# Altium schematic sheet Mosquito.SchDoc
size A4
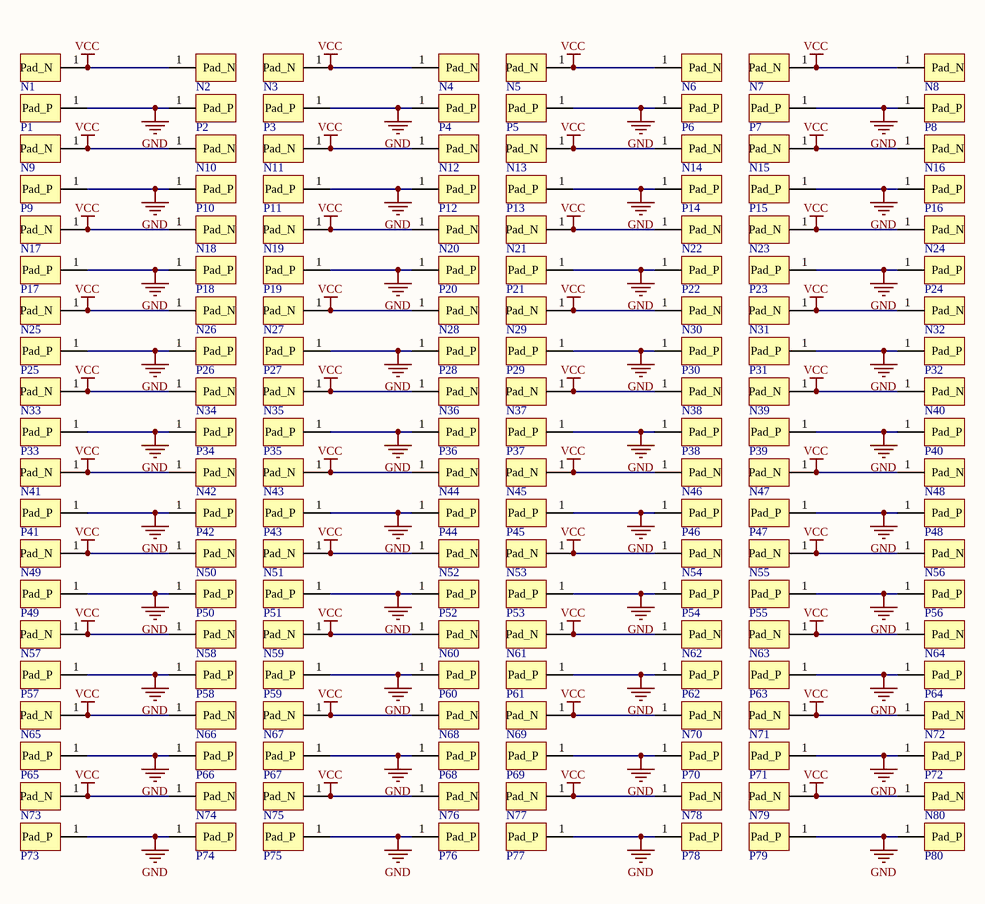
[diagram p0: Mosquito.SchDoc]

## Parts
N1  Pad_N  [Pad]  (value not drawn)
N2  Pad_N  [Pad]  (value not drawn)
N3  Pad_N  [Pad]  (value not drawn)
N4  Pad_N  [Pad]  (value not drawn)
N5  Pad_N  [Pad]  (value not drawn)
N6  Pad_N  [Pad]  (value not drawn)
N7  Pad_N  [Pad]  (value not drawn)
N8  Pad_N  [Pad]  (value not drawn)
N9  Pad_N  [Pad]  (value not drawn)
N10  Pad_N  [Pad]  (value not drawn)
N11  Pad_N  [Pad]  (value not drawn)
N12  Pad_N  [Pad]  (value not drawn)
N13  Pad_N  [Pad]  (value not drawn)
N14  Pad_N  [Pad]  (value not drawn)
N15  Pad_N  [Pad]  (value not drawn)
N16  Pad_N  [Pad]  (value not drawn)
N17  Pad_N  [Pad]  (value not drawn)
N18  Pad_N  [Pad]  (value not drawn)
N19  Pad_N  [Pad]  (value not drawn)
N20  Pad_N  [Pad]  (value not drawn)
N21  Pad_N  [Pad]  (value not drawn)
N22  Pad_N  [Pad]  (value not drawn)
N23  Pad_N  [Pad]  (value not drawn)
N24  Pad_N  [Pad]  (value not drawn)
N25  Pad_N  [Pad]  (value not drawn)
N26  Pad_N  [Pad]  (value not drawn)
N27  Pad_N  [Pad]  (value not drawn)
N28  Pad_N  [Pad]  (value not drawn)
N29  Pad_N  [Pad]  (value not drawn)
N30  Pad_N  [Pad]  (value not drawn)
N31  Pad_N  [Pad]  (value not drawn)
N32  Pad_N  [Pad]  (value not drawn)
N33  Pad_N  [Pad]  (value not drawn)
N34  Pad_N  [Pad]  (value not drawn)
N35  Pad_N  [Pad]  (value not drawn)
N36  Pad_N  [Pad]  (value not drawn)
N37  Pad_N  [Pad]  (value not drawn)
N38  Pad_N  [Pad]  (value not drawn)
N39  Pad_N  [Pad]  (value not drawn)
N40  Pad_N  [Pad]  (value not drawn)
N41  Pad_N  [Pad]  (value not drawn)
N42  Pad_N  [Pad]  (value not drawn)
N43  Pad_N  [Pad]  (value not drawn)
N44  Pad_N  [Pad]  (value not drawn)
N45  Pad_N  [Pad]  (value not drawn)
N46  Pad_N  [Pad]  (value not drawn)
N47  Pad_N  [Pad]  (value not drawn)
N48  Pad_N  [Pad]  (value not drawn)
N49  Pad_N  [Pad]  (value not drawn)
N50  Pad_N  [Pad]  (value not drawn)
N51  Pad_N  [Pad]  (value not drawn)
N52  Pad_N  [Pad]  (value not drawn)
N53  Pad_N  [Pad]  (value not drawn)
N54  Pad_N  [Pad]  (value not drawn)
N55  Pad_N  [Pad]  (value not drawn)
N56  Pad_N  [Pad]  (value not drawn)
N57  Pad_N  [Pad]  (value not drawn)
N58  Pad_N  [Pad]  (value not drawn)
N59  Pad_N  [Pad]  (value not drawn)
N60  Pad_N  [Pad]  (value not drawn)
N61  Pad_N  [Pad]  (value not drawn)
N62  Pad_N  [Pad]  (value not drawn)
N63  Pad_N  [Pad]  (value not drawn)
N64  Pad_N  [Pad]  (value not drawn)
N65  Pad_N  [Pad]  (value not drawn)
N66  Pad_N  [Pad]  (value not drawn)
N67  Pad_N  [Pad]  (value not drawn)
N68  Pad_N  [Pad]  (value not drawn)
N69  Pad_N  [Pad]  (value not drawn)
N70  Pad_N  [Pad]  (value not drawn)
N71  Pad_N  [Pad]  (value not drawn)
N72  Pad_N  [Pad]  (value not drawn)
N73  Pad_N  [Pad]  (value not drawn)
N74  Pad_N  [Pad]  (value not drawn)
N75  Pad_N  [Pad]  (value not drawn)
N76  Pad_N  [Pad]  (value not drawn)
N77  Pad_N  [Pad]  (value not drawn)
N78  Pad_N  [Pad]  (value not drawn)
N79  Pad_N  [Pad]  (value not drawn)
N80  Pad_N  [Pad]  (value not drawn)
P1  Pad_P  [Pad]  (value not drawn)
P2  Pad_P  [Pad]  (value not drawn)
P3  Pad_P  [Pad]  (value not drawn)
P4  Pad_P  [Pad]  (value not drawn)
P5  Pad_P  [Pad]  (value not drawn)
P6  Pad_P  [Pad]  (value not drawn)
P7  Pad_P  [Pad]  (value not drawn)
P8  Pad_P  [Pad]  (value not drawn)
P9  Pad_P  [Pad]  (value not drawn)
P10  Pad_P  [Pad]  (value not drawn)
P11  Pad_P  [Pad]  (value not drawn)
P12  Pad_P  [Pad]  (value not drawn)
P13  Pad_P  [Pad]  (value not drawn)
P14  Pad_P  [Pad]  (value not drawn)
P15  Pad_P  [Pad]  (value not drawn)
P16  Pad_P  [Pad]  (value not drawn)
P17  Pad_P  [Pad]  (value not drawn)
P18  Pad_P  [Pad]  (value not drawn)
P19  Pad_P  [Pad]  (value not drawn)
P20  Pad_P  [Pad]  (value not drawn)
P21  Pad_P  [Pad]  (value not drawn)
P22  Pad_P  [Pad]  (value not drawn)
P23  Pad_P  [Pad]  (value not drawn)
P24  Pad_P  [Pad]  (value not drawn)
P25  Pad_P  [Pad]  (value not drawn)
P26  Pad_P  [Pad]  (value not drawn)
P27  Pad_P  [Pad]  (value not drawn)
P28  Pad_P  [Pad]  (value not drawn)
P29  Pad_P  [Pad]  (value not drawn)
P30  Pad_P  [Pad]  (value not drawn)
P31  Pad_P  [Pad]  (value not drawn)
P32  Pad_P  [Pad]  (value not drawn)
P33  Pad_P  [Pad]  (value not drawn)
P34  Pad_P  [Pad]  (value not drawn)
P35  Pad_P  [Pad]  (value not drawn)
P36  Pad_P  [Pad]  (value not drawn)
P37  Pad_P  [Pad]  (value not drawn)
P38  Pad_P  [Pad]  (value not drawn)
P39  Pad_P  [Pad]  (value not drawn)
P40  Pad_P  [Pad]  (value not drawn)
P41  Pad_P  [Pad]  (value not drawn)
P42  Pad_P  [Pad]  (value not drawn)
P43  Pad_P  [Pad]  (value not drawn)
P44  Pad_P  [Pad]  (value not drawn)
P45  Pad_P  [Pad]  (value not drawn)
P46  Pad_P  [Pad]  (value not drawn)
P47  Pad_P  [Pad]  (value not drawn)
P48  Pad_P  [Pad]  (value not drawn)
P49  Pad_P  [Pad]  (value not drawn)
P50  Pad_P  [Pad]  (value not drawn)
P51  Pad_P  [Pad]  (value not drawn)
P52  Pad_P  [Pad]  (value not drawn)
P53  Pad_P  [Pad]  (value not drawn)
P54  Pad_P  [Pad]  (value not drawn)
P55  Pad_P  [Pad]  (value not drawn)
P56  Pad_P  [Pad]  (value not drawn)
P57  Pad_P  [Pad]  (value not drawn)
P58  Pad_P  [Pad]  (value not drawn)
P59  Pad_P  [Pad]  (value not drawn)
P60  Pad_P  [Pad]  (value not drawn)
P61  Pad_P  [Pad]  (value not drawn)
P62  Pad_P  [Pad]  (value not drawn)
P63  Pad_P  [Pad]  (value not drawn)
P64  Pad_P  [Pad]  (value not drawn)
P65  Pad_P  [Pad]  (value not drawn)
P66  Pad_P  [Pad]  (value not drawn)
P67  Pad_P  [Pad]  (value not drawn)
P68  Pad_P  [Pad]  (value not drawn)
P69  Pad_P  [Pad]  (value not drawn)
P70  Pad_P  [Pad]  (value not drawn)
P71  Pad_P  [Pad]  (value not drawn)
P72  Pad_P  [Pad]  (value not drawn)
P73  Pad_P  [Pad]  (value not drawn)
P74  Pad_P  [Pad]  (value not drawn)
P75  Pad_P  [Pad]  (value not drawn)
P76  Pad_P  [Pad]  (value not drawn)
P77  Pad_P  [Pad]  (value not drawn)
P78  Pad_P  [Pad]  (value not drawn)
P79  Pad_P  [Pad]  (value not drawn)
P80  Pad_P  [Pad]  (value not drawn)

## Nets
GND: P1.1(Pad_P) P2.1(Pad_P) P3.1(Pad_P) P4.1(Pad_P) P5.1(Pad_P) P6.1(Pad_P) P7.1(Pad_P) P8.1(Pad_P) P9.1(Pad_P) P10.1(Pad_P) P11.1(Pad_P) P12.1(Pad_P) P13.1(Pad_P) P14.1(Pad_P) P15.1(Pad_P) P16.1(Pad_P) P17.1(Pad_P) P18.1(Pad_P) P19.1(Pad_P) P20.1(Pad_P) P21.1(Pad_P) P22.1(Pad_P) P23.1(Pad_P) P24.1(Pad_P) P25.1(Pad_P) P26.1(Pad_P) P27.1(Pad_P) P28.1(Pad_P) P29.1(Pad_P) P30.1(Pad_P) P31.1(Pad_P) P32.1(Pad_P) P33.1(Pad_P) P34.1(Pad_P) P35.1(Pad_P) P36.1(Pad_P) P37.1(Pad_P) P38.1(Pad_P) P39.1(Pad_P) P40.1(Pad_P) P41.1(Pad_P) P42.1(Pad_P) P43.1(Pad_P) P44.1(Pad_P) P45.1(Pad_P) P46.1(Pad_P) P47.1(Pad_P) P48.1(Pad_P) P49.1(Pad_P) P50.1(Pad_P) P51.1(Pad_P) P52.1(Pad_P) P53.1(Pad_P) P54.1(Pad_P) P55.1(Pad_P) P56.1(Pad_P) P57.1(Pad_P) P58.1(Pad_P) P59.1(Pad_P) P60.1(Pad_P) P61.1(Pad_P) P62.1(Pad_P) P63.1(Pad_P) P64.1(Pad_P) P65.1(Pad_P) P66.1(Pad_P) P67.1(Pad_P) P68.1(Pad_P) P69.1(Pad_P) P70.1(Pad_P) P71.1(Pad_P) P72.1(Pad_P) P73.1(Pad_P) P74.1(Pad_P) P75.1(Pad_P) P76.1(Pad_P) P77.1(Pad_P) P78.1(Pad_P) P79.1(Pad_P) P80.1(Pad_P)
VCC: N1.1(Pad_N) N2.1(Pad_N) N3.1(Pad_N) N4.1(Pad_N) N5.1(Pad_N) N6.1(Pad_N) N7.1(Pad_N) N8.1(Pad_N) N9.1(Pad_N) N10.1(Pad_N) N11.1(Pad_N) N12.1(Pad_N) N13.1(Pad_N) N14.1(Pad_N) N15.1(Pad_N) N16.1(Pad_N) N17.1(Pad_N) N18.1(Pad_N) N19.1(Pad_N) N20.1(Pad_N) N21.1(Pad_N) N22.1(Pad_N) N23.1(Pad_N) N24.1(Pad_N) N25.1(Pad_N) N26.1(Pad_N) N27.1(Pad_N) N28.1(Pad_N) N29.1(Pad_N) N30.1(Pad_N) N31.1(Pad_N) N32.1(Pad_N) N33.1(Pad_N) N34.1(Pad_N) N35.1(Pad_N) N36.1(Pad_N) N37.1(Pad_N) N38.1(Pad_N) N39.1(Pad_N) N40.1(Pad_N) N41.1(Pad_N) N42.1(Pad_N) N43.1(Pad_N) N44.1(Pad_N) N45.1(Pad_N) N46.1(Pad_N) N47.1(Pad_N) N48.1(Pad_N) N49.1(Pad_N) N50.1(Pad_N) N51.1(Pad_N) N52.1(Pad_N) N53.1(Pad_N) N54.1(Pad_N) N55.1(Pad_N) N56.1(Pad_N) N57.1(Pad_N) N58.1(Pad_N) N59.1(Pad_N) N60.1(Pad_N) N61.1(Pad_N) N62.1(Pad_N) N63.1(Pad_N) N64.1(Pad_N) N65.1(Pad_N) N66.1(Pad_N) N67.1(Pad_N) N68.1(Pad_N) N69.1(Pad_N) N70.1(Pad_N) N71.1(Pad_N) N72.1(Pad_N) N73.1(Pad_N) N74.1(Pad_N) N75.1(Pad_N) N76.1(Pad_N) N77.1(Pad_N) N78.1(Pad_N) N79.1(Pad_N) N80.1(Pad_N)